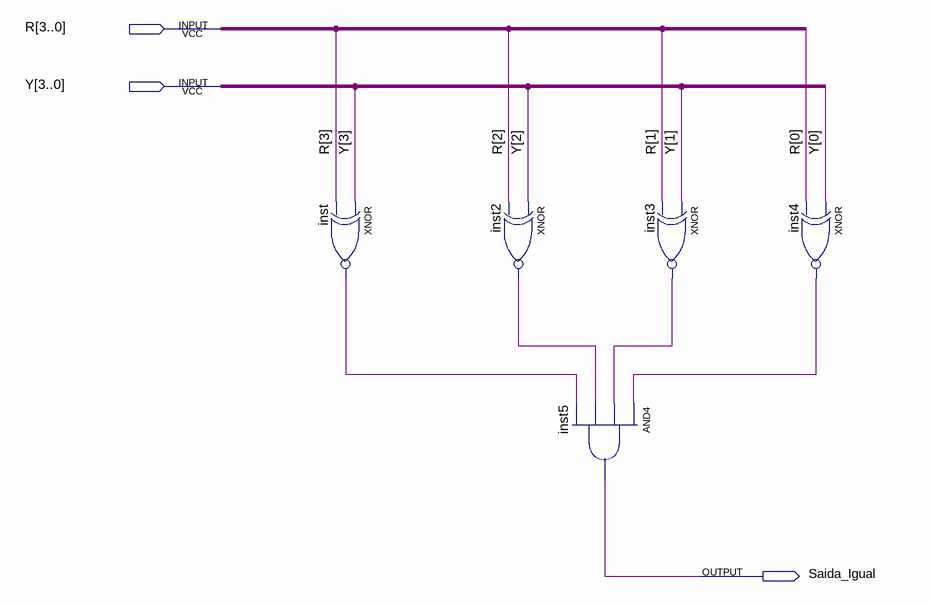
[diagram p0: schematic sheet]
// Quartus schematic IGUAL4bt.bdf as structural Verilog: 5 symbols, 3 pins
module IGUAL4bt (
  input  [3:0] R,
  input  [3:0] Y,
  output Saida_Igual
);

  wire inst2_out, inst3_out, inst4_out, inst_out;

  xnor inst (inst_out, Y[3], R[3]);
  xnor inst2 (inst2_out, Y[2], R[2]);
  and inst5 (Saida_Igual, inst4_out, inst3_out, inst2_out, inst_out);
  xnor inst3 (inst3_out, Y[1], R[1]);
  xnor inst4 (inst4_out, Y[0], R[0]);
endmodule
